# Altium project ModuloMQTT.PrjPcb
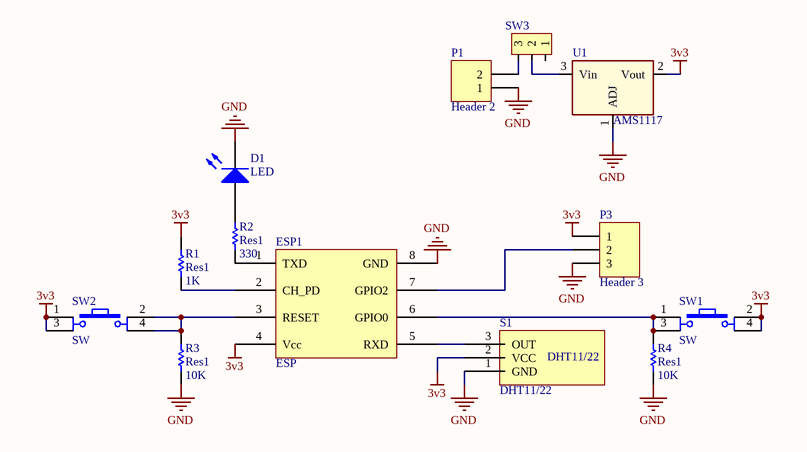
[diagram p0: ModuloMQTT.SchDoc]
1 sheet, 13 parts. Net scope: global (net labels, ports and power ports of the same name join across sheets).
Board file: ModuloMQTT.PcbDoc

## Sheet ModuloMQTT.SchDoc
size A4

### Parts
D1  LED  [LED-0 5mm BLUE]
ESP1  ESP  [ESP]
P1  Header 2  [Header 2]
P3  Header 3  [Header 3]
R1  Res1  value 1K  [AXIAL-0.3]
R2  Res1  value 330  [AXIAL-0.3]
R3  Res1  value 10K  [AXIAL-0.3]
R4  Res1  value 10K  [AXIAL-0.3]
S1  DHT11/22  [Header 3]
SW1  SW  [SW4]
SW2  SW  [SW4]
SW3  SW3  [Header 3]  (value not drawn)
U1  AMS1117  [AMS1117_No_SMD]

### Nets
3v3: ESP1.4(Vcc) P3.1 R1.1 S1.2(VCC) SW1.2 SW1.4 SW2.1 SW2.3 U1.2(Vout)
GND: D1.2(K) ESP1.8(GND) P1.1 P3.3 R3.1 R4.1 S1.1(GND) U1.1(ADJ)
NetD1_1: D1.1(A) R2.2
NetESP1_1: ESP1.1(TXD) R2.1
NetESP1_2: ESP1.2(CH_PD) R1.2
NetESP1_3: ESP1.3(RESET) R3.2 SW2.2 SW2.4
NetESP1_5: ESP1.5(RXD) S1.3(OUT)
NetESP1_6: ESP1.6(GPIO0) R4.2 SW1.1 SW1.3
NetESP1_7: ESP1.7(GPIO2) P3.2
NetP1_2: P1.2 SW3.3
NetSW3_2: SW3.2 U1.3(Vin)

Not connected (* = marked no-connect by the designer): SW3 1

### Library data of the parts
D1 = LED: Typical LED; Published: 8-Jun-2000; LatestRevisionDate: 08-Jul-2005; LatestRevisionNote: Mech Layer 1 removed.; PackageReference: LED-1; Publisher: Altium Limited
P1 = Header 2: Header, 2-Pin; LatestRevisionDate: 17-Jul-2002; LatestRevisionNote: Re-released for DXP Platform.; Publisher: Altium Limited
P3 = Header 3: Header, 3-Pin; LatestRevisionDate: 17-Jul-2002; LatestRevisionNote: Re-released for DXP Platform.; Publisher: Altium Limited
R1-R4 = Res1: Resistor; Published: 8-Jun-2000; LatestRevisionDate: 17-Jul-2002; LatestRevisionNote: Re-released for DXP Platform.; PackageReference: AXIAL-0.3; Publisher: Altium Limited; PackageDescription: Axial Device, Thru-Hole; 2 Leads; 0.3 in Pin Spacing
SW1 SW2 = SW4: Switch button 4 pin; Value: Button chip 4 pin
U1 = AMS1117: Regulator SMD Chip; Vendor: Digikey; Published: 13-April-2009; Publisher: Hoang Nguyen; ComponentLink1Description: Digikey Part Link; ComponentLink2Description: Open Datasheet; ComponentLink2URL: H:\LIBRARY\LIBRARY.Datasheet\